# EAGLE schematic Tiny Tetris v1.0 (EAGLE 6.5.0)
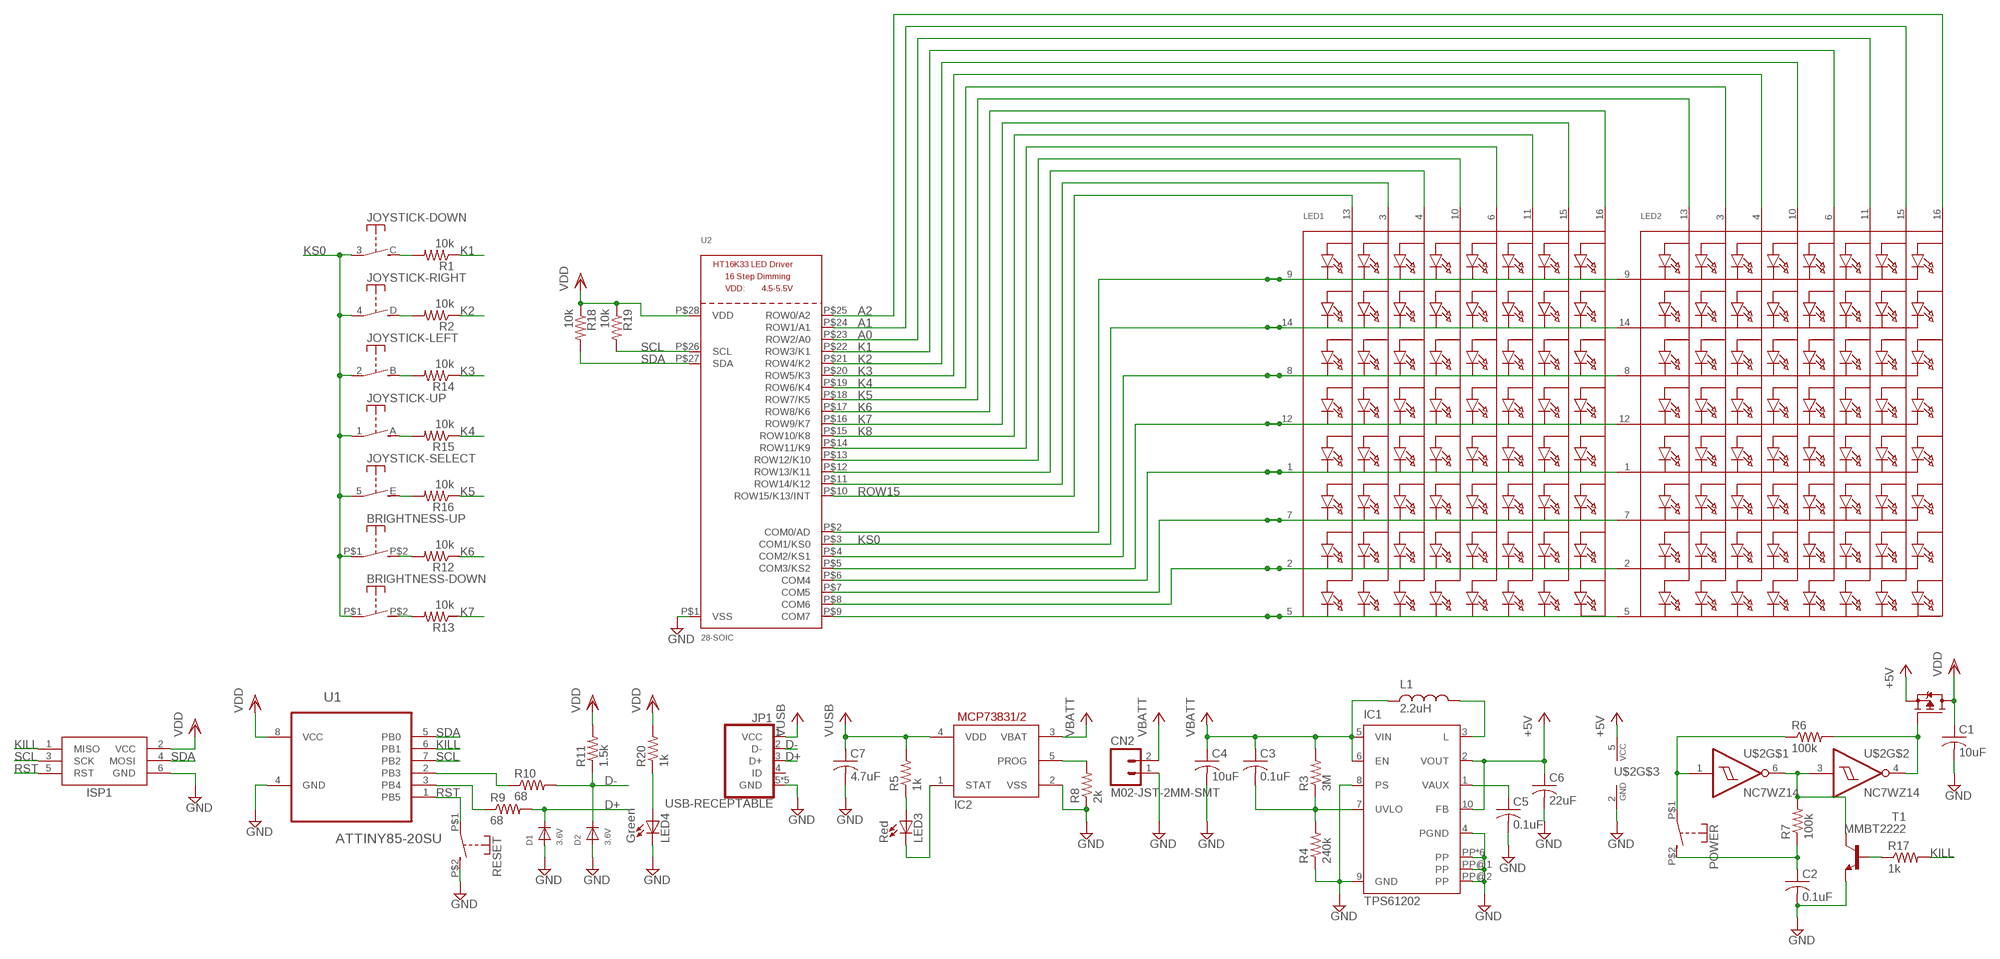
[diagram p0: schematic, sheet 1]

## Parts
BRIGHTNESS-DOWN  SWITCH-TACTSKRELGE010  [TACT-ALPS-SKRELGE010]
BRIGHTNESS-UP  SWITCH-TACTSKRELGE010  [TACT-ALPS-SKRELGE010]
C1  10uF  C-USC0603K  [C0603K]
C2  0.1uF  C-USC0603K  [C0603K]
C3  0.1uF  C-USC0603K  [C0603K]
C4  10uF  C-USC0603K  [C0603K]
C5  0.1uF  C-USC0603K  [C0603K]
C6  22uF  C-USC0603K  [C0603K]
C7  4.7uF  C-USC0603K  [C0603K]
CN2  M02-JST-2MM-SMT  M021X02_NO_SILK  [1X02_NO_SILK]
D1  3.6V  DIODESOD-323  [SOD-323]
D2  3.6V  DIODESOD-323  [SOD-323]
IC1  TPS61202  [S-PDSO-N10]
IC2  MCP73831/OT  [SOT23-5L]
ISP1  AVRISP-6  [AVRISP]
JOYSTICK-  SWITCH-NAVIGATION  [JOYSTICK-NOKIA-3230]
JP1  USB-RECEPTABLE  [FCI-10103594-0001LF]
L1  2.2uH  LPS3015  [LPS3015]
LED1  DISP_SEGMENT_8X8_ROWCATHODEBL-M12A883  [SEGMENT_BL-M12A883]
LED2  DISP_SEGMENT_8X8_ROWCATHODEBL-M12A883  [SEGMENT_BL-M12A883]
LED3  Red  LED  [LED-0603-SIDEVIEW]
LED4  Green  LED  [LED-0603-SIDEVIEW]
POWER  SWITCH-TACTSKRELGE010  [TACT-ALPS-SKRELGE010]
R1  10k  R-US_R0603  [R0603]
R2  10k  R-US_R0603  [R0603]
R3  3M  R-US_R0603  [R0603]
R4  240k  R-US_R0603  [R0603]
R5  1k  R-US_R0603  [R0603]
R6  100k  R-US_R0603  [R0603]
R7  100k  R-US_R0603  [R0603]
R8  2k  R-US_R0603  [R0603]
R9  68  R-US_R0603  [R0603]
R10  68  R-US_R0603  [R0603]
R11  1.5k  R-US_R0603  [R0603]
R12  10k  R-US_R0603  [R0603]
R13  10k  R-US_R0603  [R0603]
R14  10k  R-US_R0603  [R0603]
R15  10k  R-US_R0603  [R0603]
R16  10k  R-US_R0603  [R0603]
R17  1k  R-US_R0603  [R0603]
R18  10k  R-US_R0603  [R0603]
R19  10k  R-US_R0603  [R0603]
R20  1k  R-US_R0603  [R0603]
RESET  SWITCH-TACTSKRELGE010  [TACT-ALPS-SKRELGE010]
T1  MMBT2222  MMBT2222ALT1-NPN-SOT23-BEC  [SOT23-BEC]
U1  ATTINY85-20SU  [SOIC127P798X216-8N]
U2  28-SOIC  HT16K33_SOP28  [SOP28_300MIL]
U$1  IRLML6402  [SOT23]
U$2  NC7WZ14  [SC-70-6]

## Nets
+5V: C6.1 IC1.2(VOUT) IC1.10(FB) U$1.2(S) U$2.5(VCC)
A0: LED2.11(A6) U2.P$23(ROW2/A0)
A1: LED2.15(A7) U2.P$24(ROW1/A1)
A2: LED2.16(A8) U2.P$25(ROW0/A2)
D+: D1.C JP1.3(D+) R9.2
D-: D2.C JP1.2(D-) R10.2 R11.1
GND: C1.2 C2.2 C4.2 C5.2 C6.2 C7.2 CN2.1 D1.A D2.A IC1.4(PGND) IC1.8(PS) IC1.9(GND) IC1.PP IC1.PP@1(PP) IC1.PP@2(PP) IC1.PP@3(PP) IC1.PP@4(PP) IC1.PP@5(PP) IC1.PP@6(PP) IC1.PP@7(PP) IC2.2(VSS) ISP1.6(GND) JP1.5(GND) JP1.P$1(GND) JP1.P$2(GND) JP1.P$3(GND) JP1.P$4(GND) LED4.P$2(C) R4.1 R8.1 RESET.P$2(S) T1.E U1.4(GND) U2.P$1(VSS) U$2.2(GND)
K1: LED2.6(A5) R1.1 U2.P$22(ROW3/K1)
K2: LED2.10(A4) R2.1 U2.P$21(ROW4/K2)
K3: LED2.4(A3) R14.1 U2.P$20(ROW5/K3)
K4: LED2.3(A2) R15.1 U2.P$19(ROW6/K4)
K5: LED2.13(A1) R16.1 U2.P$18(ROW7/K5)
K6: LED1.16(A8) R12.1 U2.P$17(ROW8/K6)
K7: LED1.15(A7) R13.1 U2.P$16(ROW9/K7)
K8: LED1.11(A6) U2.P$15(ROW10/K8)
KILL: ISP1.1(MISO) R17.2 U1.6(PB1)
KS0: BRIGHTNESS-DOWN.P$1(P) BRIGHTNESS-UP.P$1(P) JOYSTICK-.1(UP:P) JOYSTICK-.2(LEFT:P) JOYSTICK-.3(DOWN:P) JOYSTICK-.4(RIGHT:P) JOYSTICK-.5(SELECT:P) LED1.14(K2) LED2.14(K2) U2.P$3(COM1/KS0)
N$1: LED1.5(K8) LED2.5(K8) U2.P$9(COM7)
N$2: LED3.P$1(A) R5.1
N$3: JOYSTICK-.C(DOWN:S) R1.2
N$4: R6.2 U$1.1(G) U$2.4(O)
N$5: R17.1 T1.B
N$6: POWER.P$1(P) R6.1 U$2.1(I)
N$7: JOYSTICK-.D(RIGHT:S) R2.2
N$8: LED1.9(K1) LED2.9(K1) U2.P$2(COM0/AD)
N$9: IC1.3(L) L1.P$2
N$10: C2.1 POWER.P$2(S) R7.1
N$11: JOYSTICK-.B(LEFT:S) R14.2
N$12: R7.2 T1.C U$2.3(I) U$2.6(O)
N$13: JOYSTICK-.A(UP:S) R15.2
N$14: C5.1 IC1.1(VAUX)
N$15: JOYSTICK-.E(SELECT:S) R16.2
N$16: C3.2 IC1.7(UVLO) R3.1 R4.2
N$17: IC2.1(STAT) LED3.P$2(C)
N$18: IC2.5(PROG) R8.2
N$19: R9.1 U1.3(PB4)
N$20: R10.1 U1.2(PB3)
N$21: BRIGHTNESS-UP.P$2(S) R12.2
N$22: LED1.3(A2) U2.P$11(ROW14/K12)
N$23: LED1.4(A3) U2.P$12(ROW13/K11)
N$24: LED1.10(A4) U2.P$13(ROW12/K10)
N$25: LED1.6(A5) U2.P$14(ROW11/K9)
N$26: BRIGHTNESS-DOWN.P$2(S) R13.2
N$27: LED4.P$1(A) R20.1
N$30: LED1.8(K3) LED2.8(K3) U2.P$4(COM2/KS1)
N$32: LED1.12(K4) LED2.12(K4) U2.P$5(COM3/KS2)
N$33: LED1.1(K5) LED2.1(K5) U2.P$6(COM4)
N$34: LED1.7(K6) LED2.7(K6) U2.P$7(COM5)
N$35: LED1.2(K7) LED2.2(K7) U2.P$8(COM6)
ROW15: LED1.13(A1) U2.P$10(ROW15/K13/INT)
RST: ISP1.5(RST) RESET.P$1(P) U1.1(PB5)
SCL: ISP1.3(SCK) R19.2 U1.7(PB2) U2.P$26(SCL)
SDA: ISP1.4(MOSI) R18.2 U1.5(PB0) U2.P$27(SDA)
VBATT: C3.1 C4.1 CN2.2 IC1.5(VIN) IC1.6(EN) IC2.3(VBAT) L1.P$1 R3.2
VDD: C1.1 ISP1.2(VCC) R11.2 R18.1 R19.1 R20.2 U1.8(VCC) U2.P$28(VDD) U$1.3(D)
VUSB: C7.1 IC2.4(VDD) JP1.1(VCC) R5.2
Unconnected: JP1.4(ID)

## Library data of the parts
BRIGHTNESS-DOWN BRIGHTNESS-UP POWER RESET = Jianan Li:SWITCH-TACT
C1-C7 = resistor:C-US: CAPACITOR, American symbol
CN2 = SparkFun-Connectors:M02: Standard 2-pin 0.1" header. Use with - straight break away headers ( PRT-00116) - right angle break away headers (PRT-00553) - swiss pins (PRT-00743) - machine pins (PRT-00117) - female headers (PRT-00115) Molex polarized connector foot print use with: PRT-08233 with associated crimp pins and housings. 2.54_SCREWTERM for use with PRT-10571. 3.5mm Screw Terminal footprints for PRT-08084 5mm Screw Terminal footprints for use with PRT-08433
D1 D2 = microbuilder:DIODE: Diode SMA Model Volts Amps Type Vf Vr Digikey # Notes SSA34-E3 40V 3A Schottky 480mV @ 3A 200uA @ 40V SSA34-E3/61TGITR-ND CDBA120-G 20V 1A Schottky 500mV @ 1A 500uA @ 20V 641-1014-6-ND REEL MBRA210 10V 2A Schottky 350mV @ 2A 700uA @ 10V MBRA210LT3 SOD-123 Model Volts Amps Type Vf Vr Order # Notes BAT54T1G 30V 200mA Schottky 800mV @ 200mA 2uA @ 25V BAT54T1GOSTR-ND B0530W 30V 500mA Schottky 430mV @ 500mA 130uA @ 30V B0530W-FDICT-ND REEL MBR120 1A 20V Schottky 340mV @ 1A MBR120VLSFT1GOSCT-ND SOD-323 Model Volts Amps Type Vf Vr Order # Notes PMEG2005EJ 20V 500mA Schottky 355mV @ 500mA 568-4110-1-ND ZLLS410 10V 570mA Schottky 380mV @ 570mA ZLLS410CT-ND 1N4148WS 75V 150mA Silicon/Simple 1V 1N4148WSFSCT-ND REEL SOD-523 Model Volts Amps Type Vf Vr Order # Notes BAT54XV2 30V 200mA Schottky 0.8V @ 100mA BAT54XV2CT-ND TB751S 30V 30mA Schottky RB751S-40TE61CT-ND SOT23-R/W (R = Solder Paste/Reflow Ovens, W = Hand-Soldering) Model Volts Amps Type Vf Vr Order # Notes BAT54FILM 40V 300mA Schottky 497-7162-1-ND
IC1 = texas:TPS6120*: LOW INPUT VOLTAGE SYNCHRONOUS BOOST CONVERTER WITH 1.3-A SWITCHES Source: http://focus.ti.com/lit/ds/symlink/tps61200.pdf; MPN: TPS61202DRCR; OC_FARNELL: unknown; OC_NEWARK: 37M0069
IC2 = adafruit:MCP73831: MCP73831/2 Miniature Single-Cell, Fully Integrated Li-Ion, Li-Polymer Charge Management Controllers. Nice and small simple lipoly charge controller, with adjustable current and status output (LED) http://www.ladyada.net/library/pcb/eaglelibrary.html
ISP1 = adafruit:AVRISP: AVR ISP HEADER Standard 6 pin header for AVR programming
JOYSTICK- = Jianan Li:SWITCH-NAVIGATION
JP1 = Micro USB:USB-RECEPTABLE: USB Receptable
L1 = Coilcraft:LPS3015
LED1 LED2 = microbuilder:DISP_SEGMENT_8X8_ROWCATHODE: 8x8 LED Segment Displays: Row = Cathode 0.7" Red 8X8 Matrix, 1.9mm Round LEDs - BL-M07C881UR 1.2" Red 8x8 Matrix, 3.0mm Round LEDs - BL-M12A881UR 1.2" Red 8x8 Matrix, 3.0mm Square LEDs - BL-M12A883
LED3 LED4 = Jianan Li:LED
R1-R20 = resistor:R-US_: RESISTOR, American symbol
T1 = transistor:*-NPN-: NPN Transistror BF959 corrected 2008.03.06
U1 = Atmel_By_element14_Batch_1:ATTINY85-20SU: 8-bit Microcontroller with In-System Programmable Flash; MPN: ATTINY85-20SU; OC_FARNELL: 1455164; OC_NEWARK: 58M3797; PACKAGE: SOIC-8; SUPPLIER: Atmel
U2 = microbuilder:HT16K33_SOP28
U$1 = Jianan Li:IRLML6402
U$2 = Jianan Li:NC7WZ14